# EAGLE design 2ButtonBase (EAGLE 8.7.0)
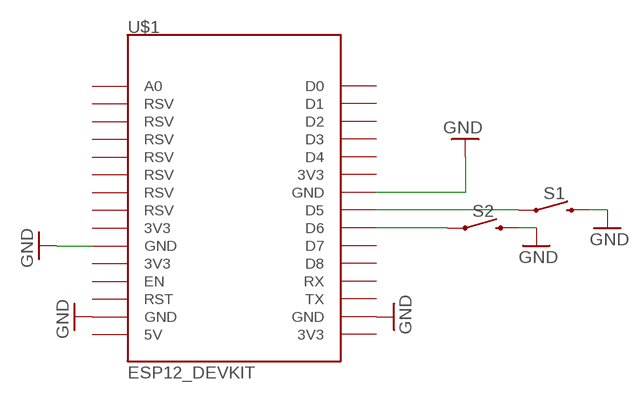
[diagram p0: schematic, sheet 1]

## Parts
S1  MOMENTARY-SWITCH-SPST-PTH-12MM  [TACTILE_SWITCH_PTH_12MM]
S2  MOMENTARY-SWITCH-SPST-PTH-12MM  [TACTILE_SWITCH_PTH_12MM]
U$1  ESP12_DEVKIT  [ESP12_DEVKIT]

## Nets
GND: S1.3 S2.3 U$1.GND@0(GND) U$1.GND@1(GND) U$1.GND@2(GND) U$1.GND@3(GND)
N$1: S1.1 U$1.D5
N$2: S2.1 U$1.D6
Unconnected: U$1.3V3@0(3V3) U$1.3V3@1(3V3) U$1.3V3@2(3V3) U$1.3V3@3(3V3) U$1.5V U$1.A0 U$1.D0 U$1.D1 U$1.D2 U$1.D3 U$1.D4 U$1.D7 U$1.D8 U$1.EN U$1.GND@4(RSV) U$1.RST U$1.RSV@0(RSV) U$1.RSV@1(RSV) U$1.RSV@2(RSV) U$1.RSV@3(RSV) U$1.RSV@4(RSV) U$1.RSV@5(RSV) U$1.RX U$1.TX

## Library data of the parts
S1 S2 = SparkFun-Switches:MOMENTARY-SWITCH-SPST: Momentary Switch (Pushbutton) - SPST Normally-open (NO) SPST momentary switches (buttons, pushbuttons). Variants PTH-12MM - 12mm square, through-hole Momentary Pushbutton Switch - 12mm Square <https://www.sparkfun.com/products/9190> (COM-09190) PTH-6.0MM, PTH-6.0MM-KIT - 6.0mm square, through-hole Mini Pushbutton Switch <https://www.sparkfun.com/products/97> (COM-00097) KIT package intended for soldering kit's - only one side of pads' copper is exposed. PTH-RIGHT-ANGLE-KIT - Right-angle, through-hole Right Angle Tactile Button <https://www.sparkfun.com/products/10791> - Used on SparkFun BigTime Watch Kit <https://www.sparkfun.com/products/11734> SMD-12MM - 12mm square, surface-mount Tactile Button - SMD (12mm) <https://www.sparkfun.com/products/12993> (COM-12993) Used on SparkFun PicoBoard <https://www.sparkfun.com/products/11888> SMD-4.5MM - 4.5mm Square Trackball Switch Used on SparkFun Blackberry Trackballer Breakout <https://www.sparkfun.com/products/13169> SMD-4.6MMX2.8MM - 4.60mm x 2.80mm, surface mount Used on SparkFun SAMD21 Mini Breakout <https://www.sparkfun.com/products/13664> SMD-5.2MM, SMD-5.2-REDUNDANT - 5.2mm square, surface-mount Mini Pushbutton Switch - SMD <https://www.sparkfun.com/products/8720> (COM-08720) Used on Arduino Pro Mini <https://www.sparkfun.com/products/11114> REDUNDANT package connects both switch circuits together SMD-6.0X3.5MM - 6.0 x 3.5mm, surface mount Momentary Reset Switch SMD <https://www.sparkfun.com/products/8229> (COM-08229) SMD-6.2MM-TALL - 6.2mm square, surface mount Tactile Button - SMD (6mm) <https://www.sparkfun.com/products/12992> Used on SparkFun Digital Sandbox <https://www.sparkfun.com/products/12651> SMD-RIGHT-ANGLE - Right-angle, surface mount Used on SparkFun Block for Intel® Edison - Arduino <https://www.sparkfun.com/products/13036>; PROD_ID: SWCH-09185; SF_SKU: COM-09190
U$1 = ESP12_DEVKIT:ESP12_DEVKIT: ESP12 DEVKIT BOARD

## Board
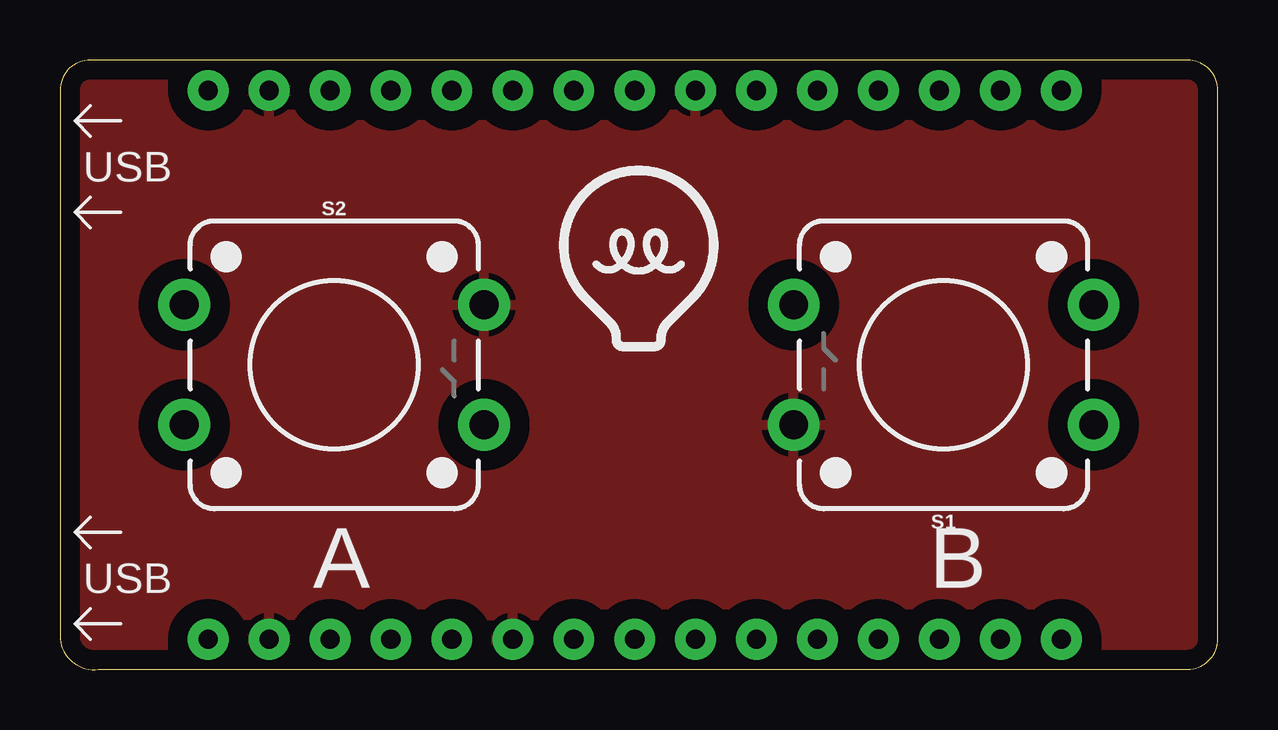
[diagram p1: board, top side]
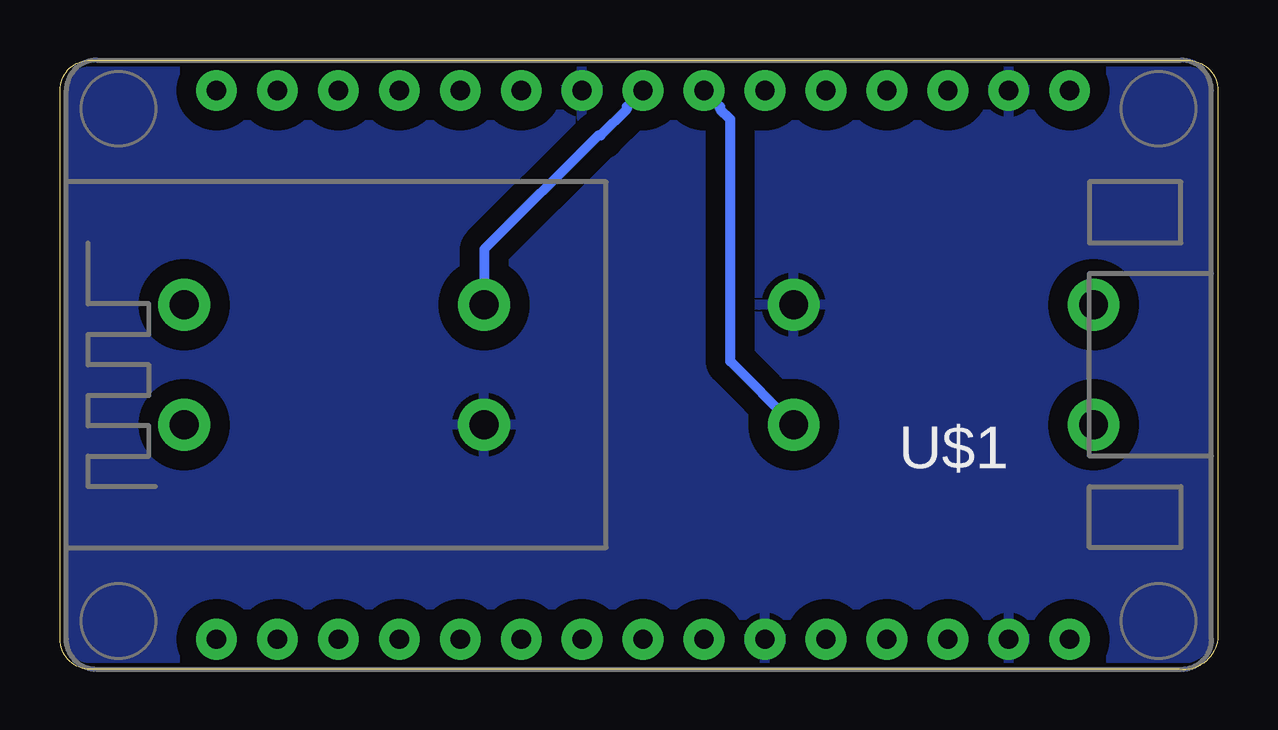
[diagram p2: board, bottom side, seen from below]

Size 48.26 x 25.4 mm. Coordinates in mm from the lower left corner, seen from the top.
Outline: 46.99,25.4 1.27,25.4 arc90 0,24.13 0,1.27 arc90 1.6,0.01 47,0.01 arc90 48.26,1.27 48.26,24.13 arc90 46.99,25.4
Copper layers (1*16): Top 0.035mm / dielectric 1.5mm / Bottom 0.035mm
Design rules "othermill_1_32": minimum track width 24mil, minimum drill 31mil, track to track 32mil, track to pad 32mil, pad to pad 32mil, via to via 32mil, smd to smd 8mil, copper to edge 10mil, drill to drill 8mil, minimum pad ring 12mil, minimum via ring 8mil, stop-mask expansion 2mil, vias tented up to drill 20mil, thermal gap 10mil

### Footprints (pad centres in the part's own frame; a part is rotated, then mirrored left to right if it is on the bottom)
TACTILE_SWITCH_PTH_12MM = drill 1.2 pad 2.159: 1 6.25,-2.5; 2 -6.25,-2.5; 3 6.25,2.5; 4 -6.25,2.5
ESP12_DEVKIT = drill 0.8 pad 1.7: 3V3@0 -11.43,-7.795; 3V3@1 11.43,4.905; 3V3@2 11.43,-17.955; 3V3@3 -11.43,-2.715; 5V -11.43,-17.955; A0 -11.43,17.605; D0 11.43,17.605; D1 11.43,15.065; D2 11.43,12.525; D3 11.43,9.985; D4 11.43,7.445; D5 11.43,-0.175; D6 11.43,-2.715; D7 11.43,-5.255; D8 11.43,-7.795; EN -11.43,-10.335; GND@0 -11.43,-5.255; GND@1 -11.43,-15.415; GND@2 11.43,2.365; GND@3 11.43,-15.415; GND@4 -11.43,-0.175; RST -11.43,-12.875; RSV@0 -11.43,15.065; RSV@1 -11.43,12.525; RSV@2 -11.43,9.985; RSV@3 -11.43,7.445; RSV@4 -11.43,4.905; RSV@5 -11.43,2.365; RX 11.43,-10.335; TX 11.43,-12.875

### Placement (x,y rotation side)
S1  36.83,12.7 180 top
S2  11.43,12.7 0 top
U$1  24.13,12.7 90 bottom
U$2  [HEEPLOGOSMALL]  24.13,17.27 0 top

### Tracks (layer width: path | path; a pad name or v marks a point on that pad's centre or on a via)
GND
  pour Top (isolate 0.813): -2.54,26.67 49.53,26.67 49.53,-2.54 -2.54,-2.54
  pour Bottom: -5.08,29.21 50.8,29.21 50.8,-5.08 -5.08,-5.08
N$1
  Bottom 0.406: S1.1 30.58,17.5 25.82,22.26 25.72,22.26 24.63,23.36 24.63,23.46 U$1.D5
N$2
  Bottom 0.406: S2.1 20.32,12.84 20.32,22.94 20.74,23.36 20.74,23.46 U$1.D6

### Text on the board
tPlace: USB | USB | A | B